# Altium schematic sheet Power.SchDoc
size A4
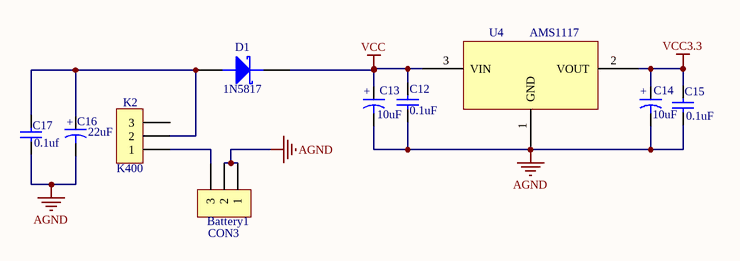
[diagram p0: Power.SchDoc]

## Parts
Battery1  CON3  [J-SOURCE-micro]
C12  value 0.1uF  [0805]  (hidden comment: Capacitor-0805)
C13  value 10uF  [钽电容1206（A3216）]  (hidden comment: 电解电容)
C14  value 10uF  [钽电容1206（A3216）]  (hidden comment: 电解电容)
C15  value 0.1uF  [0805]  (hidden comment: Capacitor-0805)
C16  value 22uF  [钽电容1206（A3216）]  (hidden comment: 电解电容)
C17  value 0.1uf  [0603]  (hidden comment: Capacitor-0603)
D1  1N5817  [1808]
K2  K400  [SS-12D01-edit]
U4  Name: AMS1117  [AMS1117-3.3(SOT-23)]  (hidden comment: AMS1117-3.3)

## Nets
AGND: Battery1.1 Battery1.2 C12.1 C13.1 C14.1 C15.1 C16.1 C17.1 U4.1(GND)
VCC: C12.2 C13.2 D1.2(K) U4.3(VIN)
VCC3.3: C14.2 C15.2 U4.2(VOUT)
NetBattery1_3: Battery1.3 K2.1
NetC16_2: C16.2 C17.2 D1.1(A) K2.2

Not connected (* = marked no-connect by the designer): K2 3

## Notes on the sheet
- (in symbol 电解电容) +

## Library data of the parts
Battery1 K2 = CON3: Connector
D1 = DIODE SCHOTTKY: Schottky Diode